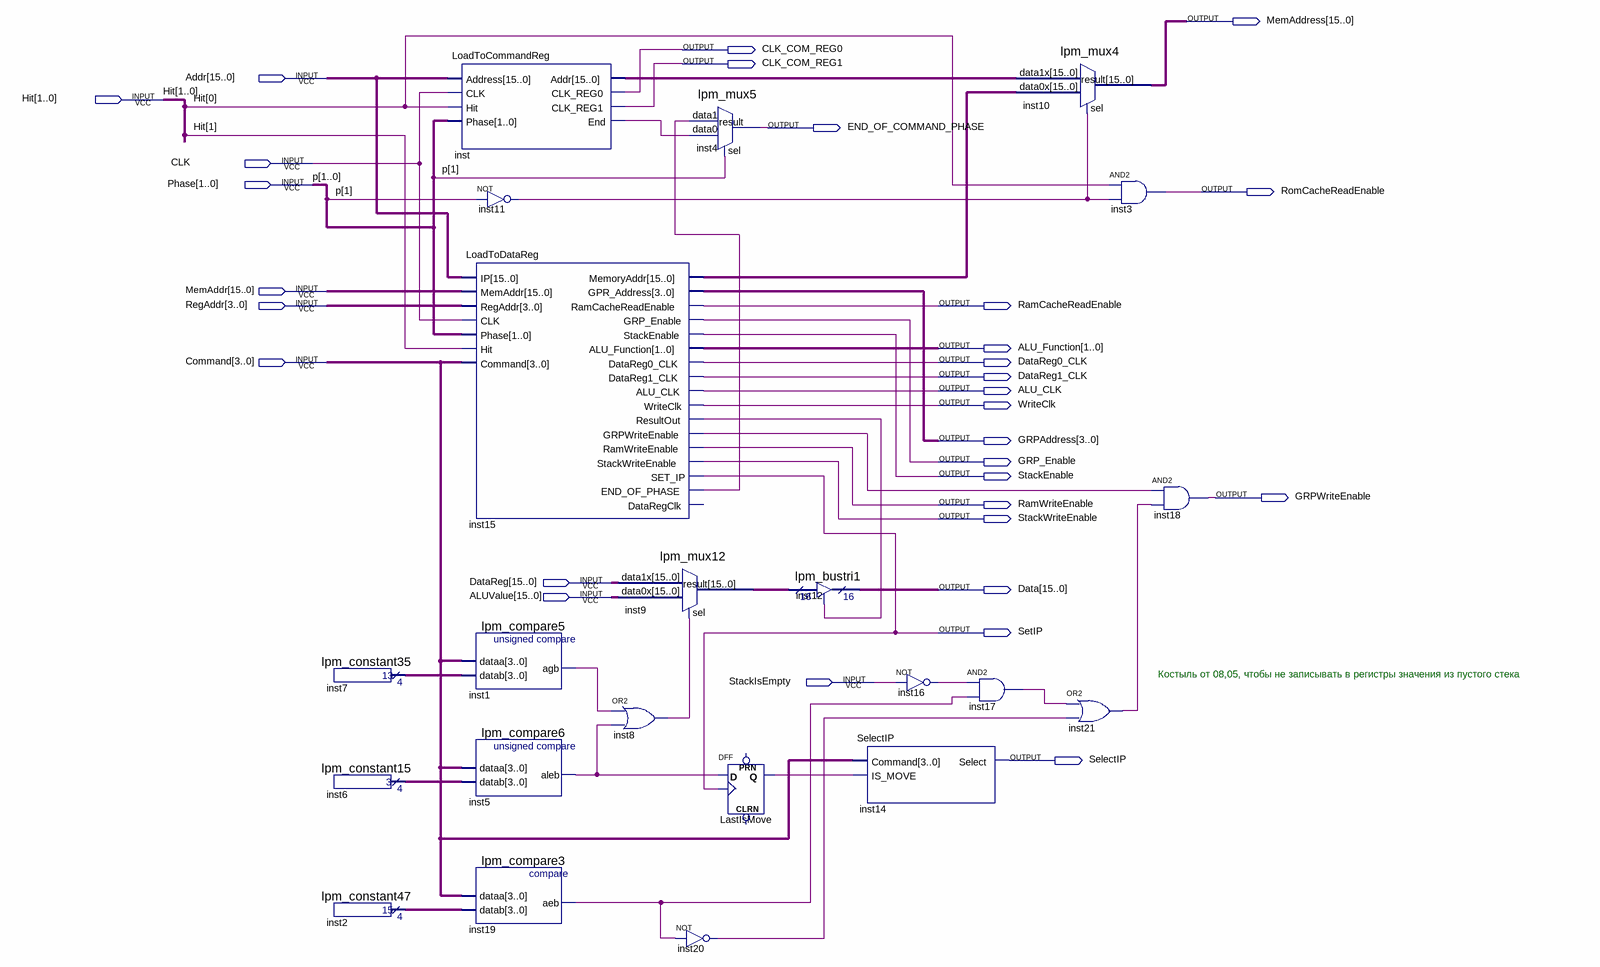
[diagram p0: schematic sheet]
// Quartus schematic LoadFromRam.bdf as structural Verilog: 22 symbols, 30 pins
module LoadFromRam (
  input  [15:0] Addr,
  input  [1:0] Hit,
  input  CLK,
  input  [1:0] Phase,
  input  [15:0] MemAddr,
  input  [3:0] RegAddr,
  input  [3:0] Command,
  input  [15:0] DataReg,
  input  [15:0] ALUValue,
  input  StackIsEmpty,
  output [15:0] MemAddress,
  output CLK_COM_REG0,
  output CLK_COM_REG1,
  output END_OF_COMMAND_PHASE,
  output RomCacheReadEnable,
  output RamCacheReadEnable,
  output [1:0] ALU_Function,
  output DataReg0_CLK,
  output DataReg1_CLK,
  output ALU_CLK,
  output WriteClk,
  output [3:0] GRPAddress,
  output GRP_Enable,
  output StackEnable,
  output GRPWriteEnable,
  output RamWriteEnable,
  output StackWriteEnable,
  output [15:0] Data,
  output SetIP,
  output SelectIP
);

  wire inst1_agb, inst5_aleb, inst8_out, inst11_out, inst15_end_of_phase, inst15_grpwriteenable,
       inst15_resultout, inst16_out, inst17_out, inst19_aeb, inst20_out, inst21_out, inst_end, LastIsMove_q;
  wire [3:0] inst2_result, inst6_result, inst7_result;
  wire [15:0] inst9_result, inst15_memoryaddr, inst_addr;

  lpm_constant35 inst7 (.result(inst7_result));
  lpm_constant15 inst6 (.result(inst6_result));
  lpm_constant47 inst2 (.result(inst2_result));
  LoadToCommandReg inst (
    .Address(Addr), .CLK(CLK), .Hit(Hit[0]), .Phase(Phase), .Addr(inst_addr), .CLK_REG0(CLK_COM_REG0),
    .CLK_REG1(CLK_COM_REG1), .End(inst_end));
  not inst11 (inst11_out, Phase[1]);
  LoadToDataReg inst15 (
    .IP(Addr), .MemAddr(MemAddr), .RegAddr(RegAddr), .CLK(CLK), .Phase(Phase), .Hit(Hit[1]),
    .Command(Command), .MemoryAddr(inst15_memoryaddr), .GPR_Address(GRPAddress),
    .RamCacheReadEnable(RamCacheReadEnable), .GRP_Enable(GRP_Enable), .StackEnable(StackEnable),
    .ALU_Function(ALU_Function), .DataReg0_CLK(DataReg0_CLK), .DataReg1_CLK(DataReg1_CLK), .ALU_CLK(ALU_CLK),
    .WriteClk(WriteClk), .ResultOut(inst15_resultout), .GRPWriteEnable(inst15_grpwriteenable),
    .RamWriteEnable(RamWriteEnable), .StackWriteEnable(StackWriteEnable), .SET_IP(SetIP),
    .END_OF_PHASE(inst15_end_of_phase));  // open: DataRegClk
  lpm_compare5 inst1 (.dataa(Command), .datab(inst7_result), .agb(inst1_agb));
  lpm_compare6 inst5 (.dataa(Command), .datab(inst6_result), .aleb(inst5_aleb));
  lpm_compare3 inst19 (.dataa(Command), .datab(inst2_result), .aeb(inst19_aeb));
  lpm_mux12 inst9 (.data1x(DataReg), .data0x(ALUValue), .sel(inst8_out), .result(inst9_result));
  or inst8 (inst8_out, inst1_agb, inst5_aleb);
  not inst20 (inst20_out, inst19_aeb);
  lpm_mux5 inst4 (.data1(inst15_end_of_phase), .data0(inst_end), .sel(Phase[1]), .result(END_OF_COMMAND_PHASE));
  DFF LastIsMove (.CLK(SetIP), .D(inst5_aleb), .Q(LastIsMove_q));  // open: CLRN, PRN
  lpm_bustri1 inst12 (.enabledt(inst15_resultout), .data(inst9_result), .tridata(Data));
  not inst16 (inst16_out, StackIsEmpty);
  SelectIP inst14 (.Command(Command), .IS_MOVE(LastIsMove_q), .Select(SelectIP));
  lpm_mux4 inst10 (.data1x(inst_addr), .data0x(inst15_memoryaddr), .sel(inst11_out), .result(MemAddress));
  and inst17 (inst17_out, inst16_out, inst19_aeb);
  or inst21 (inst21_out, inst17_out, inst20_out);
  and inst3 (RomCacheReadEnable, Hit[0], inst11_out);
  and inst18 (GRPWriteEnable, inst15_grpwriteenable, inst21_out);

  // Other names for the same wires on the sheet: p[1:0] = Phase

  // Notes on the sheet:
  //   Костыль от 08,05, чтобы не записывать в регистры значения из пустого стека
endmodule
